# Altium schematic sheet SunS_Decoupler.SchDoc: SunS separator
size A4; Author: Grzegorz Gajoch; DocumentNumber: 4; SheetNumber: 4; SheetTotal: 16; Model: EM1; PageSetup: Record=PageOptions|CenterHorizontal=True|CenterVertical=True|PrintScale=0.52|XCorrection=1.00|YCorrection=1.00|PrintKind=1|BorderSize=5000000|LeftOffset=0|BottomOffset=0|Orientation=2|PaperLength=4200|PaperWidth=2970|Scale=100|PaperSource=7|PrintQuality=600|MediaType=1|DitherType=10|PaperKind=A3|PrintScaleMode=1
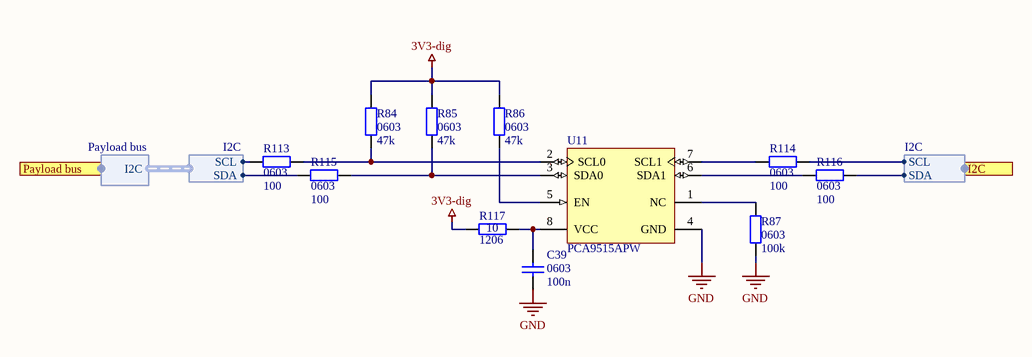
[diagram p0: SunS_Decoupler.SchDoc]

## Parts
C39  0603  value 100n  [SMD_Capacitor_0603]
R84  0603  value 47k  [SMD_Resistor_0603]
R85  0603  value 47k  [SMD_Resistor_0603]
R86  0603  value 47k  [SMD_Resistor_0603]
R87  0603  value 100k  [SMD_Resistor_0603]
R113  0603  value 100  [SMD_Resistor_0603]
R114  0603  value 100  [SMD_Resistor_0603]
R115  0603  value 100  [SMD_Resistor_0603]
R116  0603  value 100  [SMD_Resistor_0603]
R117  1206  value 10  [SMD_Resistor_1206]
U11  PCA9515APW  [PW8_L]

## Ports
I2C (harness I2C), Payload bus (harness Payload bus)

## Harnesses
I2C: SCL, SDA
Payload bus: I2C

## Nets
3V3-dig: R84.2 R85.2 R86.2 R117.2
GND: C39.1 R87.1 U11.4(GND)
NetC39_2: C39.2 R117.1 U11.8(VCC)
NetR84_1: R84.1 R113.1 U11.2(SCL0)
NetR85_1: R85.1 R115.1 U11.3(SDA0)
NetR86_1: R86.1 U11.5(EN)
NetR87_2: R87.2 U11.1(NC)
NetR113_2: R113.2 ; harness I2C.SCL
NetR114_1: R114.1 ; port I2C.SCL
NetR114_2: R114.2 U11.7(SCL1)
NetR115_2: R115.2 ; harness I2C.SDA
NetR116_1: R116.1 ; port I2C.SDA
NetR116_2: R116.2 U11.6(SDA1)

## Notes on the sheet
- Title:
- Sheet:
- of
- Author:
- Model:
- Document Number:
- Checked by:
- Iss-Rev:
- Approved by:
- Date:
- File name:

## Library data of the parts
C39 = Cap1: Capacitor; Published: 8-Jun-2000; LatestRevisionDate: 17-Jul-2002; LatestRevisionNote: Re-released for DXP Platform.; PackageReference: RAD-0.3; Publisher: Altium Limited; PackageDescription: Radial Cap, Thru-Hole; 2 Leads; 0.3 in Pin Spacing
R84-R87 R113-R117 = Res2: Resistor; Published: 8-Jun-2000; LatestRevisionDate: 17-Jul-2002; LatestRevisionNote: Re-released for DXP Platform.; PackageReference: AXIAL-0.4; Publisher: Altium Limited; PackageDescription: Axial Device, Thru-Hole; 2 Leads; 0.4 in Pin Spacing
U11 = PCA9515APW: Dual Bidirectional I2C Bus and SMBus Repeater, 2 Channel Width, 2.3 to 3.6 V, -40 to 85 degC, 8-pin TSSOP (PW), Green (RoHS & no Sb/Br); Manufacturer: Texas Instruments; SubFamily: I2C Hub, Buffer, Repeater; No. of Outputs: 2; VCC(Max)(V): 3.6; VCC(Min)(V): 2.3; Max Frequency(kHz): 400; Vcc range(V): 2.3 to 5.5; 5V Tolerant I/O: Yes; DatasheetVersion: SCPS150B; PackageVersion: revG, Feb-2011; PackageReference: PW8; PackageDescription: 8-Pin Plastic Thin Small Outline Package 3 x 4.4 mm Body ,0.65 mm Pitch; Supplier 1: Digi-Key; Supplier Part Number 1: PCA9515APW-ND; Supplier 2: Newark; Supplier Part Number 2: 80K2693; Supplier 3: Mouser; Supplier Part Number 3: 595-PCA9515APW; Eco-Plan: Green (RoHS & no Sb/Br); Channel Width: 2; Master Side I2C Bus Capacitance Supported(pF): 400; Slave Side I2C Bus Capacitance Supported(pF): 400; Open Drain I/O Type: Yes; Enable Pin: Yes; Mounting Technology: Surface Mount; PartNumber: PCA9515APW; Code_JEDEC: MO-153; ComponentLink1Description: Datasheet; ComponentLink1URL: http://www.ti.com/general/docs/lit/getliterature.tsp?genericPartNumber=PCA9515A&fileType=pdf